# Altium schematic sheet L6790A_GaN.SchDoc
size 594 x 420 mm; Author: Frank KWON; CompanyName: STMicroelectronics; DrawnBy: Frank KWON; Engineer: Frank KWON; Organization: AM&S APeC Korea; SheetNumber: 1; SheetTotal: 2
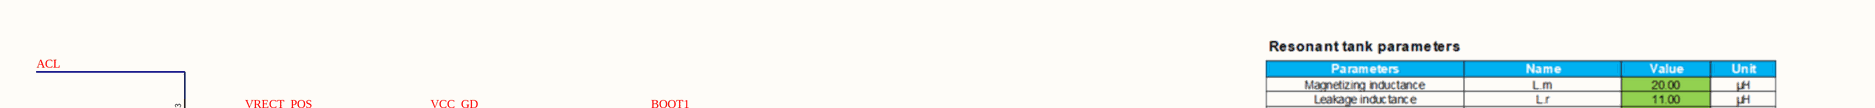
[diagram p0: L6790A_GaN.SchDoc, top left]
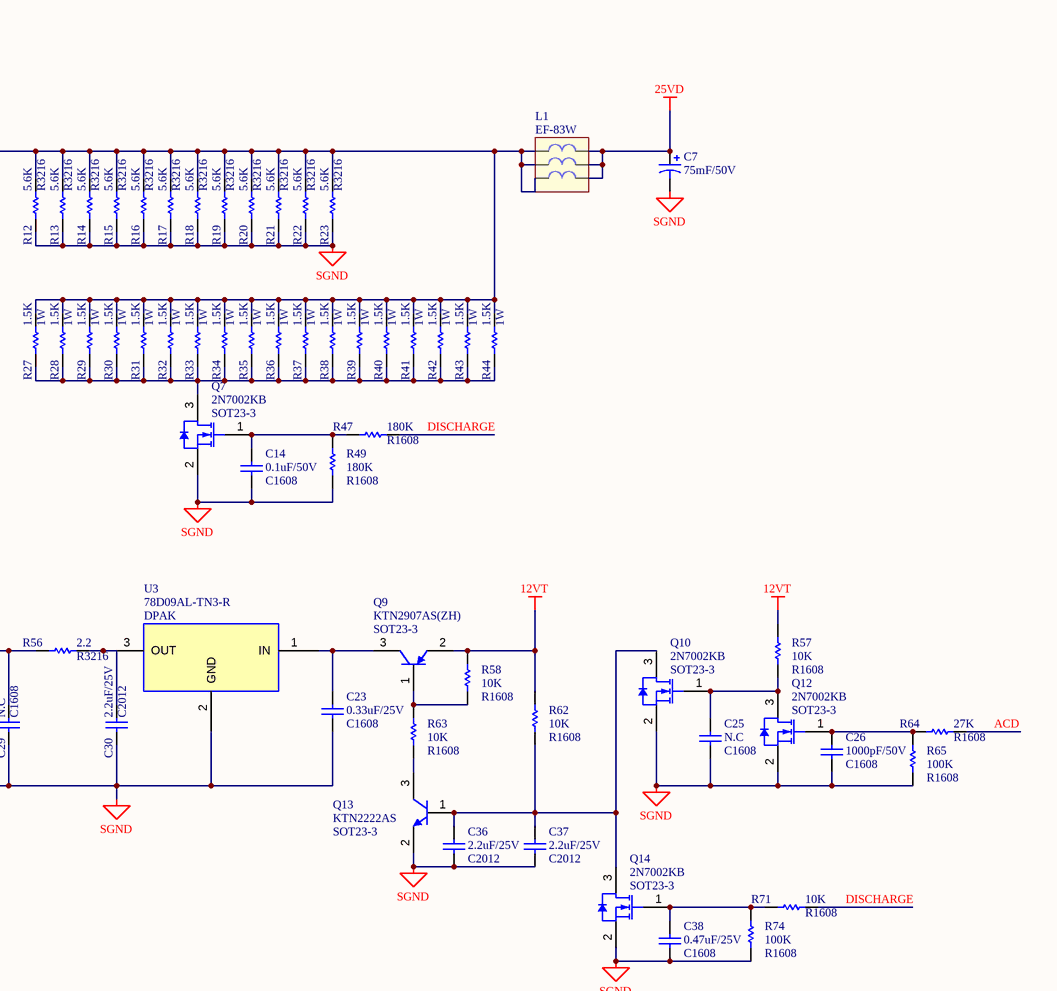
[diagram p1: L6790A_GaN.SchDoc, top right]
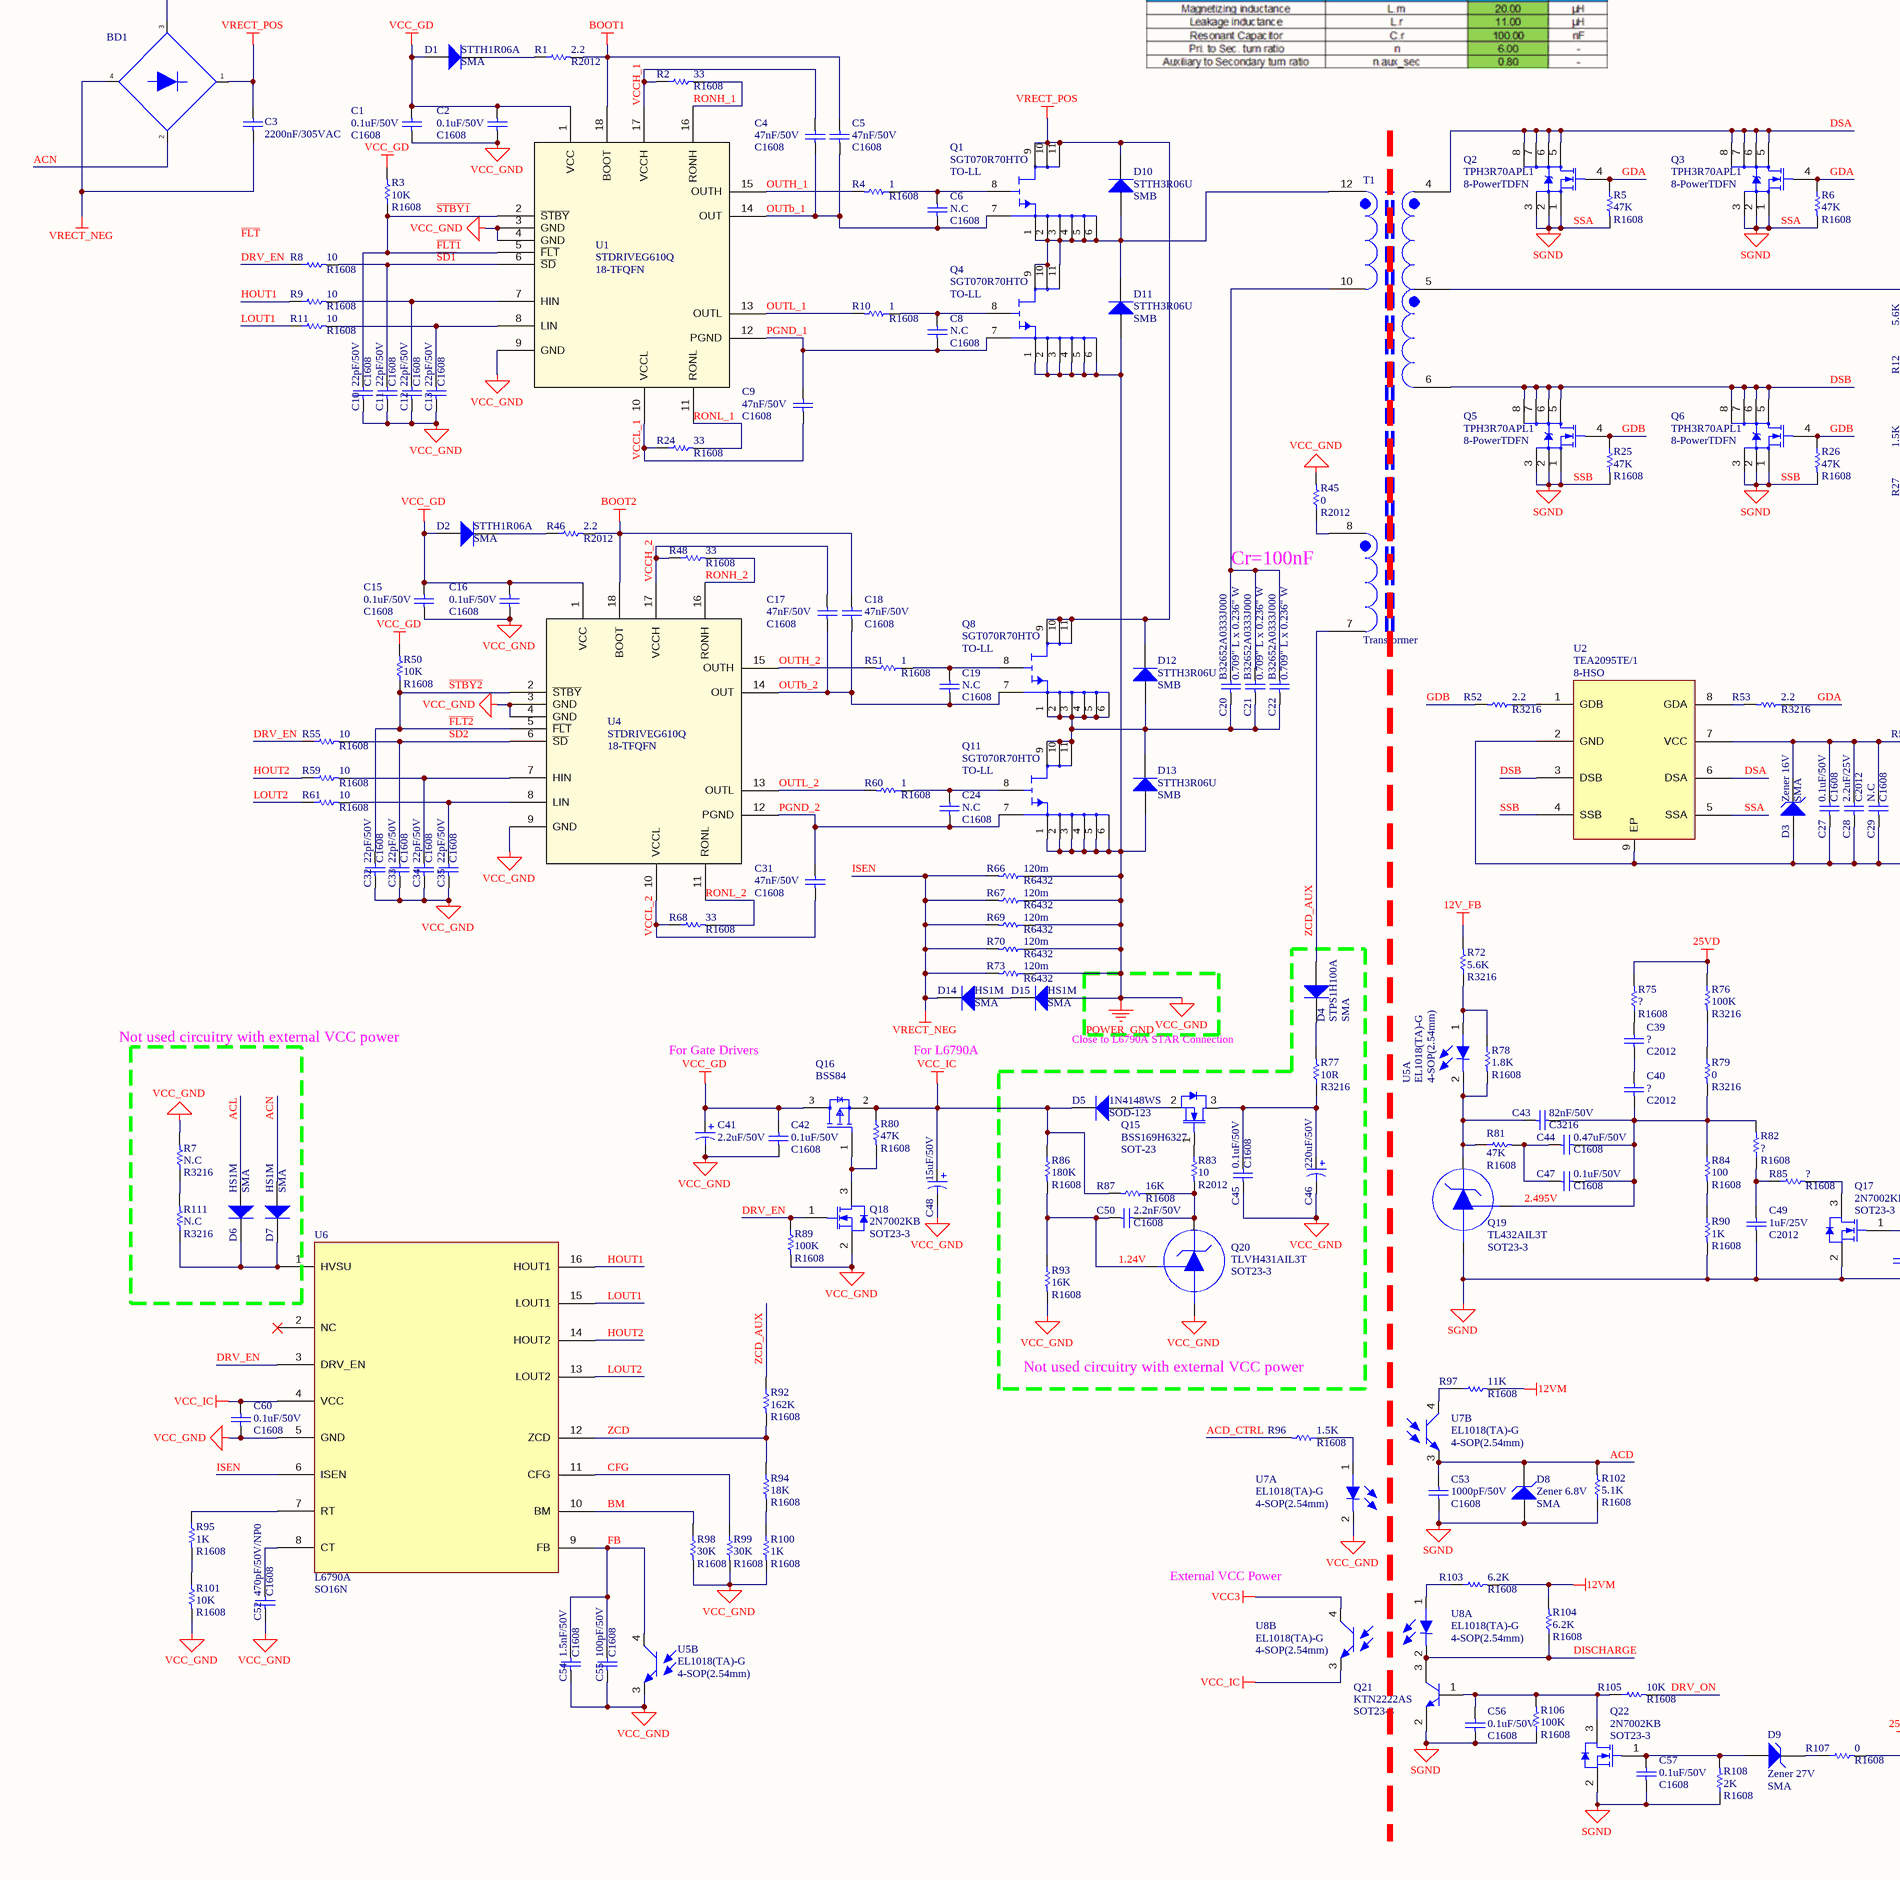
[diagram p2: L6790A_GaN.SchDoc, bottom left]
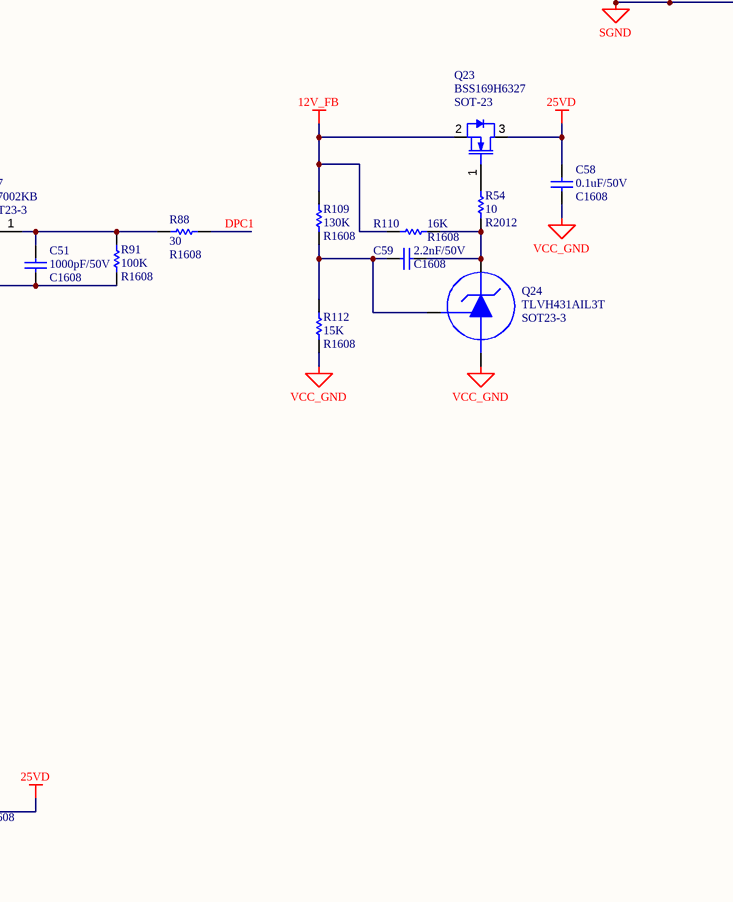
[diagram p3: L6790A_GaN.SchDoc, bottom right]

## Parts
BD1  TS6KL60  [2W-DIO-MI-4L-4_6X25X15-7_5P-BD]  (value not drawn)
C1  0.1uF/50V  Package/Case: C1608
C2  0.1uF/50V  Package/Case: C1608
C3  2200nF/305VAC
C4  47nF/50V  Package/Case: C1608
C5  47nF/50V  Package/Case: C1608
C6  N.C  Package/Case: C1608
C7  75mF/50V  [1W-CAP-MI-2L-16DX25-7_5P-EL-F-R1212]
C8  N.C  Package/Case: C1608
C9  47nF/50V  Package/Case: C1608
C10  22pF/50V  Package/Case: C1608
C11  22pF/50V  Package/Case: C1608
C12  22pF/50V  Package/Case: C1608
C13  22pF/50V  Package/Case: C1608
C14  0.1uF/50V  Package/Case: C1608
C15  0.1uF/50V  Package/Case: C1608
C16  0.1uF/50V  Package/Case: C1608
C17  47nF/50V  Package/Case: C1608
C18  47nF/50V  Package/Case: C1608
C19  N.C  Package/Case: C1608
C20  B32652A0333J000  Package/Case: 0.709" L x 0.236" W
C21  B32652A0333J000  Package/Case: 0.709" L x 0.236" W
C22  B32652A0333J000  Package/Case: 0.709" L x 0.236" W
C23  0.33uF/25V  Package/Case: C1608
C24  N.C  Package/Case: C1608
C25  N.C  Package/Case: C1608
C26  1000pF/50V  Package/Case: C1608
C27  0.1uF/50V  Package/Case: C1608
C28  2.2uF/25V  Package/Case: C2012
C29  N.C  Package/Case: C1608
C30  2.2uF/25V  Package/Case: C2012
C31  47nF/50V  Package/Case: C1608
C32  22pF/50V  Package/Case: C1608
C33  22pF/50V  Package/Case: C1608
C34  22pF/50V  Package/Case: C1608
C35  22pF/50V  Package/Case: C1608
C36  2.2uF/25V  Package/Case: C2012
C37  2.2uF/25V  Package/Case: C2012
C38  0.47uF/25V  Package/Case: C1608
C39  ?  Package/Case: C2012
C40  ?  Package/Case: C2012
C41  2.2uF/50V  [CAP-RA-D5.0H12_5-P2-R0CA]
C42  0.1uF/50V  Package/Case: C1608
C43  82nF/50V  Package/Case: C3216  [CAP-CHP-3216-R0]
C44  0.47uF/50V  Package/Case: C1608
C45  0.1uF/50V  Package/Case: C1608
C46  220uF/50V  [CAP-RA-D8H5-P2_5-R0]
C47  0.1uF/50V  Package/Case: C1608
C48  15uF/50V  [CAP-RA-D5.0H12_5-P2-R0CA]
C49  1uF/25V  Package/Case: C2012
C50  2.2nF/50V  Package/Case: C1608
C51  1000pF/50V  Package/Case: C1608
C52  470pF/50V/NP0  Package/Case: C1608
C53  1000pF/50V  Package/Case: C1608
C54  1.5nF/50V  Package/Case: C1608
C55  100pF/50V  Package/Case: C1608
C56  0.1uF/50V  Package/Case: C1608
C57  0.1uF/50V  Package/Case: C1608
C58  0.1uF/50V  Package/Case: C1608
C59  2.2nF/50V  Package/Case: C1608
C60  0.1uF/50V  Package/Case: C1608
D1  STTH1R06A  Package/Case: SMA  [DIO-SOD123]
D2  STTH1R06A  Package/Case: SMA  [DIO-SOD123]
D3  Zener 16V  Package/Case: SMA  [1W-DIO-CHP-2L-SOD106-SMA]
D4  STPS1H100A  Package/Case: SMA  [FP-6_560-5005_01-4-IPC_A]
D5  1N4148WS  Package/Case: SOD-123  [DIO-SOD123]
D6  HS1M  Package/Case: SMA  [DIO-SOD123]
D7  HS1M  Package/Case: SMA  [DIO-SOD123]
D8  Zener 6.8V  Package/Case: SMA  [1W-DIO-CHP-2L-SOD106-SMA]
D9  Zener 27V  Package/Case: SMA  [1W-DIO-CHP-2L-SOD106-SMA]
D10  STTH3R06U  Package/Case: SMB  [DIO-SOD123]
D11  STTH3R06U  Package/Case: SMB  [DIO-SOD123]
D12  STTH3R06U  Package/Case: SMB  [DIO-SOD123]
D13  STTH3R06U  Package/Case: SMB  [DIO-SOD123]
D14  HS1M  Package/Case: SMA  [DIO-SOD123]
D15  HS1M  Package/Case: SMA  [DIO-SOD123]
L1  EF-83W
Q1  SGT070R70HTO  Package/Case: TO-LL
Q2  TPH3R70APL1  Package/Case: 8-PowerTDFN
Q3  TPH3R70APL1  Package/Case: 8-PowerTDFN
Q4  SGT070R70HTO  Package/Case: TO-LL
Q5  TPH3R70APL1  Package/Case: 8-PowerTDFN
Q6  TPH3R70APL1  Package/Case: 8-PowerTDFN
Q7  2N7002KB  Package/Case: SOT23-3
Q8  SGT070R70HTO  Package/Case: TO-LL
Q9  KTN2907AS(ZH)  Package/Case: SOT23-3
Q10  2N7002KB  Package/Case: SOT23-3
Q11  SGT070R70HTO  Package/Case: TO-LL
Q12  2N7002KB  Package/Case: SOT23-3
Q13  KTN2222AS  Package/Case: SOT23-3
Q14  2N7002KB  Package/Case: SOT23-3
Q15  BSS169H6327  Package/Case: SOT-23  [SOT-23_TR]
Q16  BSS84  [FP-318-08-IPC_A]
Q17  2N7002KB  Package/Case: SOT23-3
Q18  2N7002KB  Package/Case: SOT23-3
Q19  TL432AIL3T  Package/Case: SOT23-3  [SOT-23_TR]
Q20  TLVH431AIL3T  Package/Case: SOT23-3  [SOT-23_TR]
Q21  KTN2222AS  Package/Case: SOT23-3
Q22  2N7002KB  Package/Case: SOT23-3
Q23  BSS169H6327  Package/Case: SOT-23  [SOT-23_TR]
Q24  TLVH431AIL3T  Package/Case: SOT23-3  [SOT-23_TR]
R1  2.2  Package/Case: R2012  [RES-1608]
R2  33  Package/Case: R1608  [RES-1608]
R3  10K  Package/Case: R1608  [RES-1608]
R4  1  Package/Case: R1608  [RES-1608]
R5  47K  Package/Case: R1608  [RES-1608]
R6  47K  Package/Case: R1608  [RES-1608]
R7  N.C  Package/Case: R3216  [RES-3216]
R8  10  Package/Case: R1608  [RES-1608]
R9  10  Package/Case: R1608  [RES-1608]
R10  1  Package/Case: R1608  [RES-1608]
R11  10  Package/Case: R1608  [RES-1608]
R12  5.6K  Package/Case: R3216  [RES-3216]
R13  5.6K  Package/Case: R3216  [RES-3216]
R14  5.6K  Package/Case: R3216  [RES-3216]
R15  5.6K  Package/Case: R3216  [RES-3216]
R16  5.6K  Package/Case: R3216  [RES-3216]
R17  5.6K  Package/Case: R3216  [RES-3216]
R18  5.6K  Package/Case: R3216  [RES-3216]
R19  5.6K  Package/Case: R3216  [RES-3216]
R20  5.6K  Package/Case: R3216  [RES-3216]
R21  5.6K  Package/Case: R3216  [RES-3216]
R22  5.6K  Package/Case: R3216  [RES-3216]
R23  5.6K  Package/Case: R3216  [RES-3216]
R24  33  Package/Case: R1608  [RES-1608]
R25  47K  Package/Case: R1608  [RES-1608]
R26  47K  Package/Case: R1608  [RES-1608]
R27  1.5K  Package/Case: 1W
R28  1.5K  Package/Case: 1W
R29  1.5K  Package/Case: 1W
R30  1.5K  Package/Case: 1W
R31  1.5K  Package/Case: 1W
R32  1.5K  Package/Case: 1W
R33  1.5K  Package/Case: 1W
R34  1.5K  Package/Case: 1W
R35  1.5K  Package/Case: 1W
R36  1.5K  Package/Case: 1W
R37  1.5K  Package/Case: 1W
R38  1.5K  Package/Case: 1W
R39  1.5K  Package/Case: 1W
R40  1.5K  Package/Case: 1W
R41  1.5K  Package/Case: 1W
R42  1.5K  Package/Case: 1W
R43  1.5K  Package/Case: 1W
R44  1.5K  Package/Case: 1W
R45  0  Package/Case: R2012  [RES-1608]
R46  2.2  Package/Case: R2012  [RES-1608]
R47  180K  Package/Case: R1608  [RES-1608]
R48  33  Package/Case: R1608  [RES-1608]
R49  180K  Package/Case: R1608  [RES-1608]
R50  10K  Package/Case: R1608  [RES-1608]
R51  1  Package/Case: R1608  [RES-1608]
R52  2.2  Package/Case: R3216  [RES-3216]
R53  2.2  Package/Case: R3216  [RES-3216]
R54  10  Package/Case: R2012  [RES-1608]
R55  10  Package/Case: R1608  [RES-1608]
R56  2.2  Package/Case: R3216  [RES-3216]
R57  10K  Package/Case: R1608  [RES-1608]
R58  10K  Package/Case: R1608  [RES-1608]
R59  10  Package/Case: R1608  [RES-1608]
R60  1  Package/Case: R1608  [RES-1608]
R61  10  Package/Case: R1608  [RES-1608]
R62  10K  Package/Case: R1608  [RES-1608]
R63  10K  Package/Case: R1608  [RES-1608]
R64  27K  Package/Case: R1608  [RES-1608]
R65  100K  Package/Case: R1608  [RES-1608]
R66  120m  Package/Case: R6432
R67  120m  Package/Case: R6432
R68  33  Package/Case: R1608  [RES-1608]
R69  120m  Package/Case: R6432
R70  120m  Package/Case: R6432
R71  10K  Package/Case: R1608  [RES-1608]
R72  5.6K  Package/Case: R3216  [RES-3216]
R73  120m  Package/Case: R6432
R74  100K  Package/Case: R1608  [RES-1608]
R75  ?  Package/Case: R1608  [RES-1608]
R76  100K  Package/Case: R3216  [RES-3216]
R77  10R  Package/Case: R3216  [RES-3216]
R78  1.8K  Package/Case: R1608  [RES-1608]
R79  0  Package/Case: R3216  [RES-3216]
R80  47K  Package/Case: R1608  [RES-1608]
R81  47K  Package/Case: R1608  [RES-1608]
R82  ?  Package/Case: R1608  [RES-1608]
R83  10  Package/Case: R2012  [RES-1608]
R84  100  Package/Case: R1608  [RES-1608]
R85  ?  Package/Case: R1608  [RES-1608]
R86  180K  Package/Case: R1608  [RES-1608]
R87  16K  Package/Case: R1608  [RES-1608]
R88  30  Package/Case: R1608  [RES-1608]
R89  100K  Package/Case: R1608  [RES-1608]
R90  1K  Package/Case: R1608  [RES-1608]
R91  100K  Package/Case: R1608  [RES-1608]
R92  162K  Package/Case: R1608  [RES-1608]
R93  16K  Package/Case: R1608  [RES-1608]
R94  18K  Package/Case: R1608  [RES-1608]
R95  1K  Package/Case: R1608  [RES-1608]
R96  1.5K  Package/Case: R1608  [RES-1608]
R97  11K  Package/Case: R1608  [RES-1608]
R98  30K  Package/Case: R1608  [RES-1608]
R99  30K  Package/Case: R1608  [RES-1608]
R100  1K  Package/Case: R1608  [RES-1608]
R101  10K  Package/Case: R1608  [RES-1608]
R102  5.1K  Package/Case: R1608  [RES-1608]
R103  6.2K  Package/Case: R1608  [RES-1608]
R104  6.2K  Package/Case: R1608  [RES-1608]
R105  10K  Package/Case: R1608  [RES-1608]
R106  100K  Package/Case: R1608  [RES-1608]
R107  0  Package/Case: R1608  [RES-1608]
R108  2K  Package/Case: R1608  [RES-1608]
R109  130K  Package/Case: R1608  [RES-1608]
R110  16K  Package/Case: R1608  [RES-1608]
R111  N.C  Package/Case: R3216  [RES-3216]
R112  15K  Package/Case: R1608  [RES-1608]
T1  Transformer
U1  STDRIVEG610Q  Package/Case: 18-TFQFN
U2  TEA2095TE/1  Package/Case: 8-HSO
U3  78D09AL-TN3-R  Package/Case: DPAK
U4  STDRIVEG610Q  Package/Case: 18-TFQFN
U5  EL1018(TA)-G  Package/Case: 4-SOP(2.54mm)  [1W-IC-CHP-4L-3_6X7_6-2_54P-L10_2-PC]  (parts A,B of 2)
U6  L6790A  Package/Case: SO16N
U7  EL1018(TA)-G  Package/Case: 4-SOP(2.54mm)  [1W-IC-CHP-4L-3_6X7_6-2_54P-L10_2-PC]  (parts A,B of 2)
U8  EL1018(TA)-G  Package/Case: 4-SOP(2.54mm)  [1W-IC-CHP-4L-3_6X7_6-2_54P-L10_2-PC]  (parts A,B of 2)

## Blocks framed on the sheet
Not used circuitry with external VCC power: C45 C46 C50 D4 D5 Q15 Q20 R77 R83 R86 R87 R93

## Nets
12V_FB: Q23.2(SOURCE) R72.2 R109.1 R110.2
12VM: R97.2 R103.2 R104.2
12VT: Q9.2(E) R57.1 R58.1 R62.1
25VD: C7.1 C58.1 L1.2 Q23.3(DRAIN) R75.2 R76.1 R107.2
BOOT1: C5.1 R1.2 U1.18(BOOT)
BOOT2: C18.1 R46.2 U4.18(BOOT)
ISEN: BD1.4 C3.1 D14.2(K) R66.2 R67.2 R69.2 R70.2 R73.2 U6.6(ISEN)  [also labelled VRECT_NEG]
POWER_GND: C1.2 C2.2 C10.2 C11.2 C12.2 C13.2 C15.2 C16.2 C32.2 C33.2 C34.2 C35.2 C41.2 C42.2 C45.2 C46.2 C48.2 C52.2 C54.2 C55.2 C58.2 C60.2 D11.1(A) D13.1(A) D15.1(A) Q4.1(S) Q4.2(S) Q4.3(S) Q4.4(S) Q4.5(S) Q4.6(S) Q11.1(S) Q11.2(S) Q11.3(S) Q11.4(S) Q11.5(S) Q11.6(S) Q18.2(S) Q20.3(A) Q24.3(A) R7.2 R45.2 R66.1 R67.1 R69.1 R70.1 R73.1 R89.2 R93.2 R98.2 R99.2 R100.2 R101.2 R112.2 U1.3(GND) U1.4(GND) U1.9(GND) U4.3(GND) U4.4(GND) U4.9(GND) U5.3(E) U6.5(GND) U7.2(C)  [also labelled VCC_GND]
SSA: C7.2 C14.2 C23.2 C25.2 C26.2 C27.2 C28.2 C29.2 C30.2 C36.2 C37.2 C38.2 C49.2 C51.2 C53.2 C56.1 C57.1 D3.1(A) D8.1(A) Q2.1(S) Q2.2(S) Q2.3(S) Q3.1(S) Q3.2(S) Q3.3(S) Q5.1(S) Q5.2(S) Q5.3(S) Q6.1(S) Q6.2(S) Q6.3(S) Q7.2(S) Q10.2(S) Q12.2(S) Q13.2(E) Q14.2(S) Q17.2(S) Q19.3(A) Q21.2(E) Q22.2(S) R5.2 R6.2 R12.1 R13.1 R14.1 R15.1 R16.1 R17.1 R18.1 R19.1 R20.1 R21.1 R22.1 R23.1 R25.2 R26.2 R49.2 R65.2 R74.2 R90.2 R91.1 R102.1 R106.1 R108.1 U2.2(GND) U2.4(SSB) U2.5(SSA) U2.9(EP) U3.2(GND)  [also labelled SGND, SSB]
VCC3: U8.4(C)
VCC_GD: C1.1 C2.1 C15.1 C16.1 C41.1 C42.1 D1.1(A) D2.1(A) Q16.3(D) R3.2 R50.2 U1.1(VCC) U4.1(VCC)
VCC_IC: C48.1 C60.1 D5.2(K) Q16.2(S) R80.1 R86.1 R87.2 U6.4(VCC) U8.3(E)
VRECT_POS: BD1.1 C3.2 D10.2(K) D12.2(K) Q1.9(D) Q1.10(D) Q1.11(D) Q8.9(D) Q8.10(D) Q8.11(D)
1.24V: C50.1 Q20.1(R) R86.2 R93.1
2.495V: C40.2 C43.1 C44.1 C47.1 Q19.1(R) R79.2 R82.2 R84.1
~{FLT1}: C10.1 R3.1 U1.2(~{STBY}) U1.5(~{FLT})  [also labelled ~{STBY1}]
~{FLT2}: C32.1 R50.1 U4.2(~{STBY}) U4.5(~{FLT})  [also labelled ~{STBY2}]
~{SD1}: C11.1 R8.2 U1.6(~{SD})
~{SD2}: C33.1 R55.2 U4.6(~{SD})
ACD: C53.1 D8.2(K) R64.2 R102.2 U7.3(E)
ACD_CTRL: R96.2
ACL: BD1.3 D6.1(A)
ACN: BD1.2 D7.1(A)
BM: R98.1 U6.10(BM)
CFG: R99.1 U6.11(CFG)
DISCHARGE: Q21.3(C) R47.2 R71.2 R104.1 U8.2(C)
DPC1: R88.2
DRV_EN: Q18.1(G) R8.1 R55.1 R89.1 U6.3(DRV_EN)
DRV_ON: R105.2
DSA: Q2.5(D) Q2.6(D) Q2.7(D) Q2.8(D) Q3.5(D) Q3.6(D) Q3.7(D) Q3.8(D) T1.4 U2.6(DSA)
DSB: Q5.5(D) Q5.6(D) Q5.7(D) Q5.8(D) Q6.5(D) Q6.6(D) Q6.7(D) Q6.8(D) T1.6 U2.3(DSB)
FB: C54.1 C55.1 U5.4(C) U6.9(FB)
GDA: Q2.4(G) Q3.4(G) R5.1 R6.1 R53.1
GDB: Q5.4(G) Q6.4(G) R25.1 R26.1 R52.2
HOUT1: R9.1 U6.16(HOUT1)
HOUT2: R59.1 U6.14(HOUT2)
LOUT1: R11.1 U6.15(LOUT1)
LOUT2: R61.1 U6.13(LOUT2)
OUTb_1: C4.2 C5.2 C6.2 Q1.7(KS) U1.14(OUT)
OUTb_2: C17.2 C18.2 C19.2 Q8.7(KS) U4.14(OUT)
OUTH_1: R4.2 U1.15(OUTH)
OUTH_2: R51.2 U4.15(OUTH)
OUTL_1: R10.2 U1.13(OUTL)
OUTL_2: R60.2 U4.13(OUTL)
PGND_1: C8.2 C9.1 Q4.7(KS) U1.12(PGND)
PGND_2: C24.2 C31.1 Q11.7(KS) U4.12(PGND)
RONH_1: R2.2 U1.16(RONH)
RONH_2: R48.2 U4.16(RONH)
RONL_1: R24.2 U1.11(RONL)
RONL_2: R68.2 U4.11(RONL)
VCCH_1: C4.1 R2.1 U1.17(VCCH)
VCCH_2: C17.1 R48.1 U4.17(VCCH)
VCCL_1: C9.2 R24.1 U1.10(VCCL)
VCCL_2: C31.2 R68.1 U4.10(VCCL)
ZCD: R92.2 R94.1 U6.12(ZCD)
ZCD_AUX: D4.1(A) R92.1 T1.7
NetC6_1: C6.1 Q1.8(G) R4.1
NetC8_1: C8.1 Q4.8(G) R10.1
NetC12_1: C12.1 R9.2 U1.7(HIN)
NetC13_1: C13.1 R11.2 U1.8(LIN)
NetC14_1: C14.1 Q7.1(G) R47.1 R49.1
NetC19_1: C19.1 Q8.8(G) R51.1
NetC20_1: C20.1 C21.1 C22.1 T1.10
NetC20_2: C20.2 C21.2 C22.2 D12.1(A) D13.2(K) Q8.1(S) Q8.2(S) Q8.3(S) Q8.4(S) Q8.5(S) Q8.6(S) Q11.9(D) Q11.10(D) Q11.11(D)
NetC23_1: C23.1 Q9.3(C) U3.1(IN)
NetC24_1: C24.1 Q11.8(G) R60.1
NetC25_1: C25.1 Q10.1(G) Q12.3(D) R57.2
NetC26_1: C26.1 Q12.1(G) R64.1 R65.1
NetC27_1: C27.1 C28.1 C29.1 D3.2(K) R56.2 U2.7(VCC)
NetC30_1: C30.1 R56.1 U3.3(OUT)
NetC34_1: C34.1 R59.2 U4.7(HIN)
NetC35_1: C35.1 R61.2 U4.8(LIN)
NetC36_1: C36.1 C37.1 Q10.3(D) Q13.1(B) Q14.3(D) R62.2
NetC38_1: C38.1 Q14.1(G) R71.1 R74.1
NetC39_1: C39.1 R75.1
NetC39_2: C39.2 C40.1
NetC43_2: C43.2 Q19.2(K) R78.2 R81.1 U5.2(C)
NetC44_2: C44.2 C47.2 R81.2
NetC45_1: C45.1 C46.1 Q15.3(DRAIN) R77.1
NetC49_1: C49.1 R82.1 R85.1
NetC50_2: C50.2 Q20.2(K) R83.2 R87.1
NetC51_1: C51.1 Q17.1(G) R88.1 R91.2
NetC52_1: C52.1 U6.8(CT)
NetC56_2: C56.2 Q21.1(B) Q22.3(D) R105.1 R106.2
NetC57_2: C57.2 D9.1(A) Q22.1(G) R108.2
NetC59_1: C59.1 Q24.1(R) R109.2 R112.1
NetC59_2: C59.2 Q24.2(K) R54.2 R110.1
NetD1_2: D1.2(K) R1.1
NetD2_2: D2.2(K) R46.1
NetD4_2: D4.2(K) R77.2
NetD5_1: D5.1(A) Q15.2(SOURCE)
NetD6_2: D6.2(K) D7.2(K) R111.1 U6.1(HVSU)
NetD9_2: D9.2(K) R107.1
NetD10_1: D10.1(A) D11.2(K) Q1.1(S) Q1.2(S) Q1.3(S) Q1.4(S) Q1.5(S) Q1.6(S) Q4.9(D) Q4.10(D) Q4.11(D) T1.12
NetD14_1: D14.1(A) D15.2(K)
NetL1_1: L1.1 R12.2 R13.2 R14.2 R15.2 R16.2 R17.2 R18.2 R19.2 R20.2 R21.2 R22.2 R23.2 R27.2 R28.2 R29.2 R30.2 R31.2 R32.2 R33.2 R34.2 R35.2 R36.2 R37.2 R38.2 R39.2 R40.2 R41.2 R42.2 R43.2 R44.2 T1.5
NetQ7_3: Q7.3(D) R27.1 R28.1 R29.1 R30.1 R31.1 R32.1 R33.1 R34.1 R35.1 R36.1 R37.1 R38.1 R39.1 R40.1 R41.1 R42.1 R43.1 R44.1
NetQ9_1: Q9.1(B) R58.2 R63.1
NetQ13_3: Q13.3(C) R63.2
NetQ15_1: Q15.1(GATE) R83.1
NetQ16_1: Q16.1(G) Q18.3(D) R80.2
NetQ17_3: Q17.3(D) R85.2
NetQ23_1: Q23.1(GATE) R54.1
NetR7_1: R7.1 R111.2
NetR45_1: R45.1 T1.8
NetR52_1: R52.1 U2.1(GDB)
NetR53_2: R53.2 U2.8(GDA)
NetR72_1: R72.1 R78.1 U5.1(A)
NetR76_2: R76.2 R79.1
NetR84_2: R84.2 R90.1
NetR94_2: R94.2 R100.1
NetR95_1: R95.1 U6.7(RT)
NetR95_2: R95.2 R101.1
NetR96_1: R96.1 U7.1(A)
NetR97_1: R97.1 U7.4(C)
NetR103_1: R103.1 U8.1(A)

Not connected (* = marked no-connect by the designer): U6 2(NC)*

## Notes on the sheet
- Cr=100nF
- Not used circuitry with external VCC power
- For Gate Drivers
- For L6790A
- Close to L6790A STAR Connection
- External VCC Power
- Labels drawn without touching a wire or pin: ~{FLT}
- DWG NO:
- REV:
- THIS DOCUMENT AND THE DATA DISCLOSED HEREIN OR
- HEREWITH IS THE PROPERTY OF ALTIUM LIMITED AND MAY
- BE FREELY DISTRIBUTED IN WHOLE. NO RIGHTS ARE
- RESERVED OR EXPRESS OR IMPLIED WARANTEE GIVEN.
- REVISION
- DESCRIPTION
- DATE
- APPROVED
- ENG:
- APPROVALS
- PROJECT
- DSN:
- CHK:
- REFERENCE DOCUMENTS
- PROJECT REVISION:
- TITLE
- DOCUMENT REVISION:
- DESIGN ITEM:
- BOM:
- FAB DWG:
- PCB DWG:
- ASSY DWG:
- SCALE:
- A2
- SIZE
- CAGE CODE
- FILE NAME
- DWG NO.
- SHEET
- OF
- REV

## Library data of the parts
BD1 = BRIDGE: BRIDGE DIODE; Mount Type: DIP
C1-C6 C8-C40 C42-C45 C47 C49-C60 = Cap: Chip MLCC
  C1-C6 C8-C38 C42 C45 C50-C60: Mounting Type: SMD
  C39 C40 C43 C44 C47 C49: Mount Type: SMD
C7 = Cap Pol1: Electrolytic Capacitor; Mount Type: DIP
C41 C48 = Cap Pol1: Electrolytic Capacitor 33uF/25V; Mount Type: DIP
C46 = Cap Pol1: Electrolytic Capacitor 22uF/100V; Mount Type: DIP
D1 D2 D5-D7 D10-D15 = Diode 1N4148: DIODE SCHOTTKY 30V 200MA SOD123; Mount Type: SMD
D3 D8 D9 = D Zener: DIODE ZENER 30V 1W DO214AC; Mount Type: SMD
D4 = Diode 1N4148: DIODE STANDARD 200V 200MA SOD80; Mount Type: SMD
Q1 Q4 Q8 Q11 = SGT070R70HTO: 700 V, 53 mΩ typ., 26 A, e-mode PowerGaN transistor; ComponentLink1URL: http://www.nexperia.com/; ComponentLink2URL: https://assets.nexperia.com/documents/data-sheet/GAN080-650EBE.pdf; Mounting Type: SMD
Q2 Q3 Q5 Q6 = TPH3R70APL1: N-Channel 100 V 90A (Tc) 210W (Tc) Surface Mount 8-SOP Advance (5x5.75); Mount Type: SMD
Q7 Q10 Q12 Q14 Q17 Q18 Q22 = 2N7002KB: N-CH MOSFET; Mounting Type: SMD
Q9 = ONSC-PNP-B1E2C3-3: PNP BJT; Mounting Type: SMD
Q13 Q21 = ONSC-NPN-B1E2C3-3: BJT NPN; Mounting Type: SMD
Q15 Q23 = CMP-32901-000982-1: MOSFET N-CH 100V 170MA SOT23-3; Mount Type: SMD
Q16 = CMP-1058-00762-2: MOSFET P-CH 50V 130MA SOT-23; Max Power Dissipation: 225mW; On-State Resistance: 10R; Nominal Vgs: 2V; Gate to Source Voltage (Vgs): 20V; Rise Time: 1ns; Turn-Off Delay Time: 16ns; Voltage Rating (DC): -50V; Turn-On Delay Time: 3.6ns; Number of Elements: 1; Current Rating: -130mA; Input Capacitance: 30pF; Threshold Voltage: -2V; Element Configuration: Single; Drain to Source Breakdown Voltage: 50V; Continuous Drain Current (ID): 130mA; Length: 0.119inch; Drain to Source Voltage (Vdss): 50V; Min Operating Temperature: -55°C; Contact Plating: Tin; Lead Free: Lead Free; Width: 0.055inch; Case/Package: SOT-23-3; Max Operating Temperature: 150°C; Halogen Free: Halogen Free; Radiation Hardening: No; Drain to Source Resistance: 10R; REACH SVHC: No SVHC; Power Dissipation: 225mW; Number of Pins: 3; Package Quantity: 1; Packaging: Tape and Reel; Fall Time: 1ns; Rds On Max: 10R; Height: 0.04inch
Q19 Q20 Q24 = 1W-IC-CHP-3L-SOT23-SCR-R0: IC VREF SHUNT ADJ 1% SOT23-3; Mount Type: SMD
R1-R26 R45-R112 = Res1: Chip Resistor; Mount Type: SMD
R27-R44 = Res1: Watt Resistor; Mount Type: SMD
U1 U4 = STDRIVEG610Q: High voltage and high-speed half-bridge gate driver for GaN power switches
U2 = TEA2095TE/1: LLC SR CONTROLLER IC; Mounting Type: SMD
U3 = 78D09AL-TN3-R: 3-TERMINALS 1A POSITIVE VOLTAGE REGULATOR; Mounting Type: SMD
U5 U7 U8 = SFH617A-2X019T: Photocoupler; Mount Type: SMD
U6 = L6790A: LLC-PFC controller IC for insulated power factor corrector application; Mounting Type: SMD
T1 = Transformer: Mount Type: DIP